# Altium schematic sheet Power.SchDoc
size 419 x 296 mm; SheetNumber: 3; SheetTotal: 5
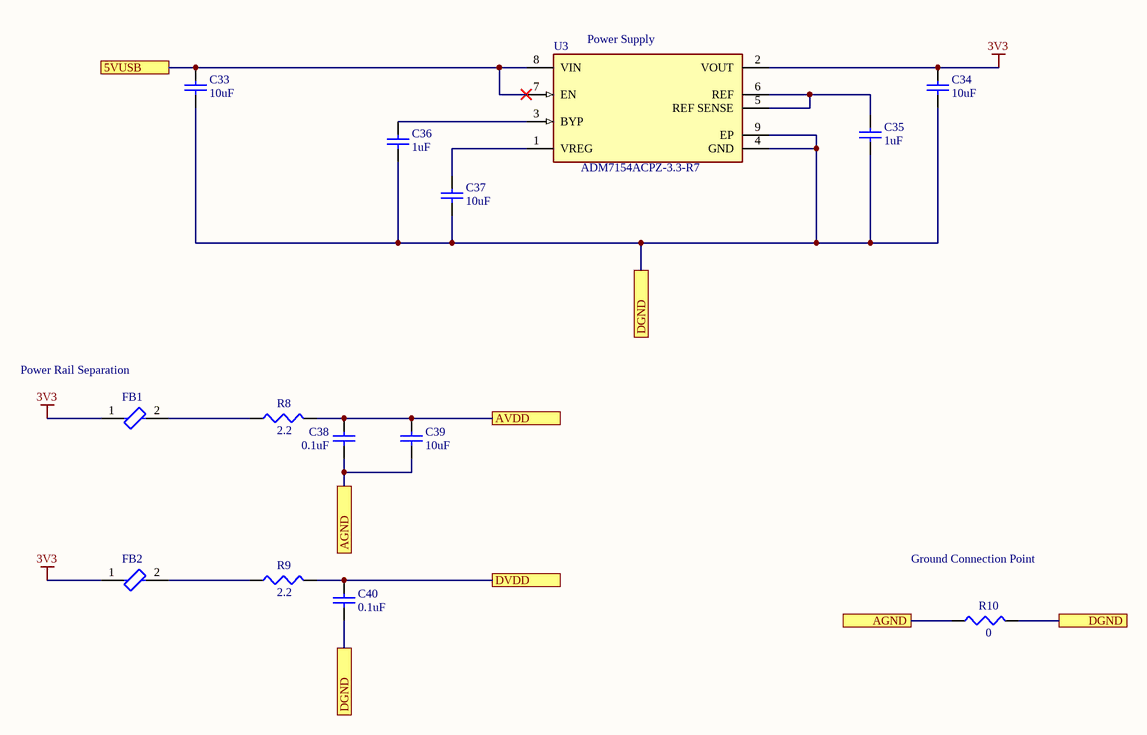
[diagram p0: Power.SchDoc]

## Parts
C33  value 10uF  [0402 SMD]  (hidden comment: C0402C106M9PAC7867)
C34  value 10uF  [0402 SMD]  (hidden comment: C0402C106M9PAC7867)
C35  value 1uF  [0402 SMD]  (hidden comment: C0402C105K8PAC7867)
C36  value 1uF  [0402 SMD]  (hidden comment: C0402C105K8PAC7867)
C37  value 10uF  [0402 SMD]  (hidden comment: C0402C106M9PAC7867)
C38  value 0.1uF  [0402 SMD]  (hidden comment: C0402C104K4RAC7867)
C39  value 10uF  [0402 SMD]  (hidden comment: C0402C106M9PAC7867)
C40  value 0.1uF  [0402 SMD]  (hidden comment: C0402C104K4RAC7867)
FB1  BLM15PD600SN1D  [FP-BLM15-0_05-d0_7-IPC_B]  (value not drawn)
FB2  BLM15PD600SN1D  [FP-BLM15-0_05-d0_7-IPC_B]  (value not drawn)
R8  value 2.2  [0402 SMD]  (hidden comment: SG73P1EWTTP2R20F)
R9  value 2.2  [0402 SMD]  (hidden comment: SG73P1EWTTP2R20F)
R10  value 0  [0402 SMD]  (hidden comment: RC0402FR-070RL)
U3  ADM7154ACPZ-3.3-R7  [FP-CP-8-21-IPC_C]

## Ports
5VUSB, AGND, AVDD, DGND, DVDD

## Nets
3V3: C34.2 FB1.1 FB2.1 U3.2(VOUT)
5VUSB: C33.2 U3.7(EN) U3.8(VIN) ; port 5VUSB
AGND: C38.1 C39.1 R10.1 ; port AGND
AVDD: C38.2 C39.2 R8.2 ; port AVDD
DGND: C33.1 C34.1 C35.1 C36.1 C37.1 C40.1 R10.2 U3.4(GND) U3.9(EP) ; port DGND
DVDD: C40.2 R9.2 ; port DVDD
NetC35_2: C35.2 U3.5(REF_SENSE) U3.6(REF)
NetC36_2: C36.2 U3.3(BYP)
NetC37_2: C37.2 U3.1(VREG)
NetFB1_2: FB1.2 R8.1
NetFB2_2: FB2.2 R9.1

## Notes on the sheet
- (near U3) Power Supply
- (near FB1) Power Rail Separation
- Ground Connection Point
- Title
- Revision
- Project
- Approver
- Date
- Branch
- File

## Library data of the parts
C33 C34 C37 C39 = C0402C106M9PAC7867: 10 µF ±20% 6.3V Ceramic Capacitor X5R 0402 (1005 Metric) (1005 Metric) Kemet
C35 C36 = C0402C105K8PAC7867: 1 µF ±10% 10V Ceramic Capacitor X5R 0402 (1005 Metric)
C38 C40 = C0402C104K4RAC7867: 0.1 µF ±10% 16V Ceramic Capacitor X7R 0402 (1005 Metric) Kemet
FB1 FB2 = CMP-0686-00129-3: Chip Ferrite Bead, 0402, 60Ω @ 100MHz, 0.06Ω, 25%, 1.7A; Number of Circuits: 1; DC Resistance (DCR): 60mR; Material: Steel; Impedance: 60R; Test Frequency: 100MHz; Lead Free: Lead Free; Radiation Hardening: No; Min Operating Temperature: -55°C; Case Code (Metric): 1005; Series: BLM15PD; Max Current Rating: 1.7A; Length: 1mm; Tolerance: 25%; Current Rating: 1.7A; RoHS Compliant: Yes; DC Current: 1.7A; Width: 0.5mm; Core Material: Ferrite; Number of Pins: 2; Depth: 0.55mm; Case Code (Imperial): 0402; Number of Lines: 1; Package Quantity: 1; Max Operating Temperature: 125°C; Case/Package: 0402; Termination: SMD/SMT; Packaging: Tape and Reel; Height: 0.5mm; Military Standard: Not; REACH SVHC: No SVHC; Max DC Current: 1.7A; DC Resistance-Max: 60MR
R8 R9 = SG73P1EWTTP2R20F: 2.2 Ohms ±1% 0.25W, 1/4W Chip Resistor 0402 (1005 Metric) Automotive AEC-Q200, Pulse Withstanding Thick Film
R10 = RC0402FR-070RL: 0 Ohms Jumper 0.063W, 1/16W Chip Resistor 0402 (1005 Metric) Moisture Resistant Thick Film
U3 = CMP-09138-000115-1: IC REG LINEAR 3.3V 600MA 8LFCSP; Max Input Voltage: 5.5V; Min Current Limit: 700mA; Number of Regulators: 1; Output Type: Fixed; Accuracy: 0.5%; Dropout Voltage: 120mV; Polarity: Positive; Min Input Voltage: 2.3V; Quiescent Current: 4mA; Contact Plating: Tin; Lead Free: Contains Lead; Max Output Current: 600mA; Nominal Output Voltage: 3.3V; Min Operating Temperature: -40°C; Output Voltage: 3.3V; REACH SVHC: No SVHC; Packaging: Cut Tape; RoHS Compliant: Yes; Mount: Surface Mount; Number of Outputs: 1; Number of Pins: 8; Output Current: 600mA; Max Operating Temperature: 125°C